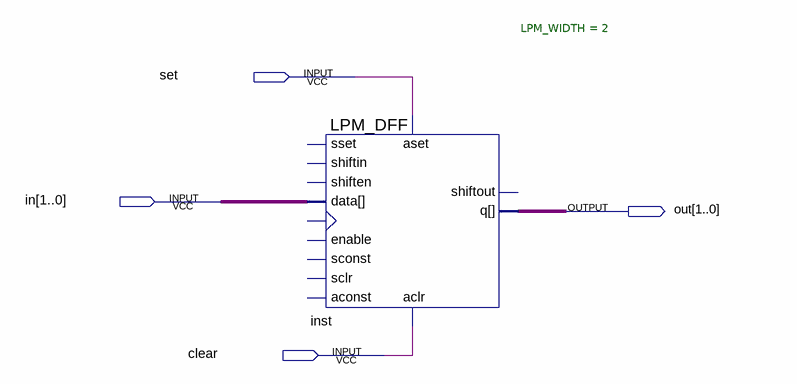
[diagram p0: schematic sheet]
// Quartus schematic Pattern_Cell.bdf as structural Verilog: 1 symbols, 4 pins
module Pattern_Cell (
  input  set,
  input  [1:0] in,
  input  clear,
  output [1:0] out
);

  LPM_DFF #(.LPM_WIDTH(2)) inst (
    .data(in), .aset(set), .aclr(clear), .q(out));  // open: shiftin, shiften, enable, clock, aconst, sclr, sconst, sset, shiftout
endmodule
